# Altium schematic sheet main.SCHDOC
size A
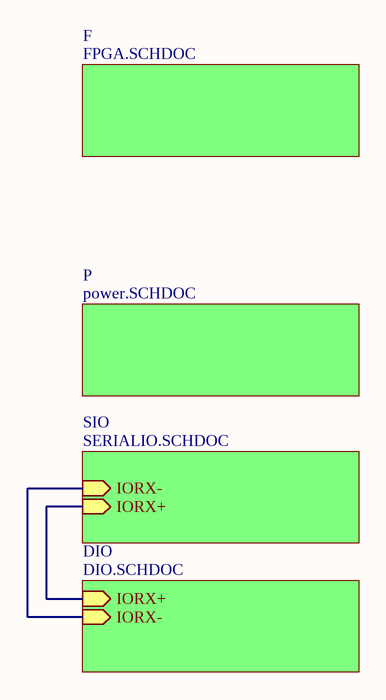
[diagram p0: main.SCHDOC]

## Sub-sheets
DIO = DIO.SCHDOC: IORX+ (in), IORX- (in)
F = FPGA.SCHDOC: no entries
P = power.SCHDOC: no entries
SIO = SERIALIO.SCHDOC: IORX- (in), IORX+ (in)

## Nets
(unnamed): sheet SIO/IORX-, sheet DIO/IORX-
(unnamed): sheet SIO/IORX+, sheet DIO/IORX+